# Altium schematic sheet Stepper Motor3.SchDoc
size A2; SheetNumber: 6; SheetTotal: 9
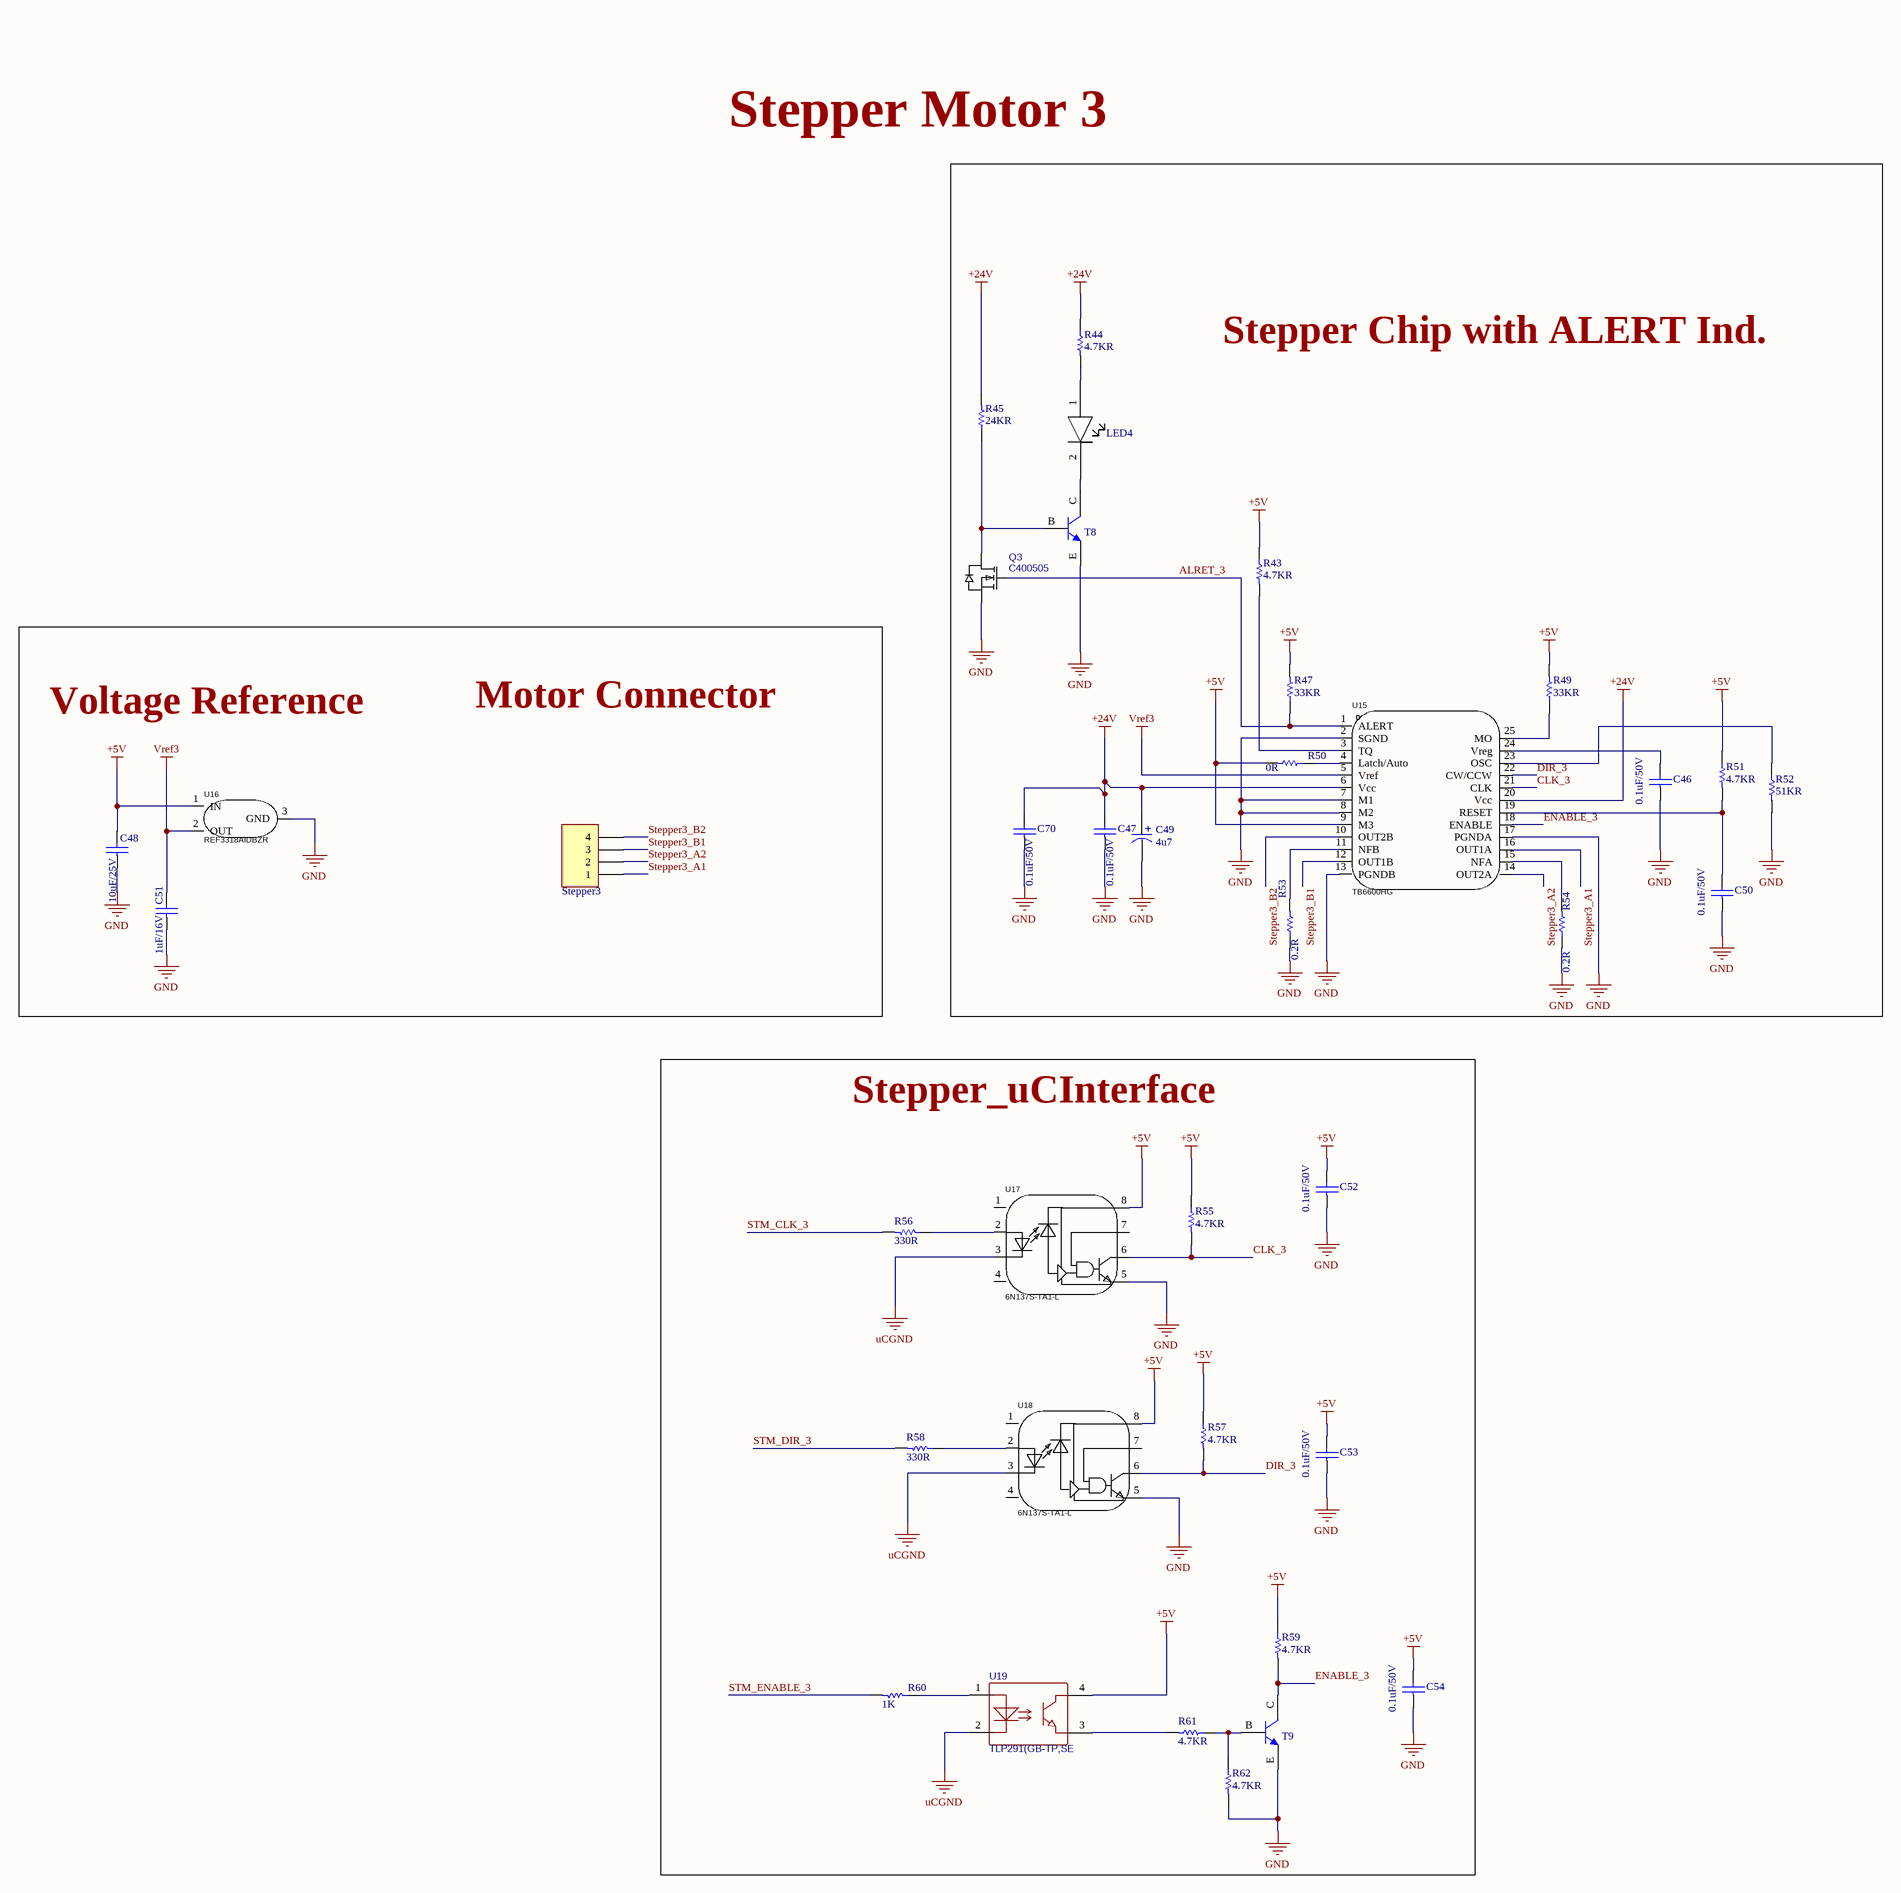
[diagram p0: Stepper Motor3.SchDoc]

## Parts
C46  0.1uF/50V  [PCBComponent_1]
C47  0.1uF/50V  [PCBComponent_1]
C48  10uF/25V  [PCBComponent_1]
C49  4u7  [CAPLEAD_D6.3mm]
C50  0.1uF/50V  [PCBComponent_1]
C51  1uF/16V  [PCBComponent_1]
C52  0.1uF/50V  [PCBComponent_1]
C53  0.1uF/50V  [PCBComponent_1]
C54  0.1uF/50V  [PCBComponent_1]
C70  0.1uF/50V  [PCBComponent_1]
LED4  1206 LED  [1206 LED]  (value not drawn)
Q3  C400505  [SOT-23-3_L2.9-W1.3-P1.90-LS2.4-BR]
R43  4.7KR  [R0402]
R44  4.7KR  [R0402]
R45  24KR  [RESC1608X06N]
R47  33KR  [RESC1608X06N]
R49  33KR  [RESC1608X06N]
R50  0R  [RESC1608X06N]
R51  4.7KR  [R0402]
R52  51KR  [R0402]
R53  0.2R  [RESC6431X12N]
R54  0.2R  [RESC6431X12N]
R55  4.7KR  [R0402]
R56  330R  [R0402]
R57  4.7KR  [R0402]
R58  330R  [R0402]
R59  4.7KR  [R0402]
R60  1K  [R0402]
R61  4.7KR  [R0402]
R62  4.7KR  [R0402]
Stepper3  Header 4 Pin Polar  [PCBComponent_1]  (value not drawn)
T8  MMBT3904 Transistor  [MMBT3904]  (value not drawn)
T9  MMBT3904 Transistor  [MMBT3904]  (value not drawn)
U15  TB6600HG  [HZIP25-P-1.0_TB6600HG - HEATSINK]
U16  REF3318AIDBZR  [SOT-23-3_L2.9-W1.3-P1.90-LS2.4-BR]
U17  6N137S-TA1-L  [SOP-8_L9.8-W6.6-P2.54-LS10.3-BL]
U18  6N137S-TA1-L  [SOP-8_L9.8-W6.6-P2.54-LS10.3-BL]
U19  TLP291(GB-TP,SE  [SOP-4-1.27mm]

## Blocks framed on the sheet
Stepper Chip with ALERT Ind.: C46 C47 C49 C50 C70 LED4 Q3 R43-R45 R47 R49-R54 T8 U15
Stepper_uCInterface: C52-C54 R55-R62 T9 U17-U19

## Nets
+5V: C48.2 C52.2 C53.2 C54.2 R43.1 R47.2 R49.2 R50.2 R51.1 R55.1 R57.1 R59.1 U15.9(M3) U16.1(IN) U17.8 U18.8 U19.4
+24V: C47.2 C49.1 C70.2 R44.1 R45.2 U15.6(Vcc) U15.20(Vcc)
GND: C46.1 C47.1 C48.1 C49.2 C50.1 C51.1 C52.1 C53.1 C54.1 C70.1 Q3.2(S) R52.2 R53.1 R54.1 R62.2 T8.E T9.E U15.2(SGND) U15.7(M1) U15.8(M2) U15.13(PGNDB) U15.17(PGNDA) U16.3(GND) U17.5 U18.5
uCGND: U17.3 U18.3 U19.2
Vref3: C51.2 U15.5(Vref) U16.2(OUT)
ALRET_3: Q3.1(G) R47.1 U15.1(ALERT)
CLK_3: R55.2 U15.21(CLK) U17.6
DIR_3: R57.2 U15.22(CW/CCW) U18.6
ENABLE_3: R59.2 T9.C U15.18(ENABLE)
Stepper3_A1: Stepper3.1 U15.16(OUT1A)
Stepper3_A2: Stepper3.2 U15.14(OUT2A)
Stepper3_B1: Stepper3.3 U15.12(OUT1B)
Stepper3_B2: Stepper3.4 U15.10(OUT2B)
STM_CLK_3: R56.2
STM_DIR_3: R58.2
STM_ENABLE_3: R60.2
NetC46_2: C46.2 U15.24(Vreg)
NetC50_2: C50.2 R51.2 U15.19(RESET)
NetLED4_1: LED4.1 R44.2
NetLED4_2: LED4.2 T8.C
NetQ3_3: Q3.3(D) R45.1 T8.B
NetR43_2: R43.2 U15.3(TQ)
NetR49_1: R49.1 U15.25(MO)
NetR50_1: R50.1 U15.4(Latch/Auto)
NetR52_1: R52.1 U15.23(OSC)
NetR53_2: R53.2 U15.11(NFB)
NetR54_2: R54.2 U15.15(NFA)
NetR56_1: R56.1 U17.2
NetR58_1: R58.1 U18.2
NetR60_1: R60.1 U19.1
NetR61_1: R61.1 R62.1 T9.B
NetR61_2: R61.2 U19.3

Not connected (* = marked no-connect by the designer): U17 1(NC) 4(NC) 7; U18 1(NC) 4(NC) 7

## Notes on the sheet
- Stepper Motor 3
- Voltage Reference
- Motor Connector

## Library data of the parts
C46 C47 C50 C52-C54 C70 = 0603 Capacitor: C1591; Created By: NourAldin; DataSheet Link: https://eu.mouser.com/datasheet/2/400/lcc_automotive_general_en-843974.pdf; Mouser Link: https://eu.mouser.com/ProductDetail/TDK/CGA1A2X7R1H331M030BA?qs=sGAEpiMZZMs0AnBnWHyRQL8L3bkL%252bvtyS9XpSB1mk7rVV5K8%252bbxEeg%3d%3d
C48 = 0603 Capacitor: C96446; Created By: NourAldin; DataSheet Link: https://eu.mouser.com/datasheet/2/400/lcc_automotive_general_en-843974.pdf; Mouser Link: https://eu.mouser.com/ProductDetail/TDK/CGA1A2X7R1H331M030BA?qs=sGAEpiMZZMs0AnBnWHyRQL8L3bkL%252bvtyS9XpSB1mk7rVV5K8%252bbxEeg%3d%3d
C49 = A759EQ475M2AAAE160: C2691843; Manufacturer: KEMET; Supplier 1: Mouser; Manufacturer Part Number: A759EQ475M2AAAE160; RoHS: Yes; Category: Polymer Capacitors; Stock 1: 17219; Pricing 1: 1=0.97, 10=0.73, 50=0.73, 100=0.546, 1000=0.384, 10000=0.326 (USD); ComponentLink1URL: http://www.kemet.com/docfinder?Partnumber=A759EQ475M2AAAE160&src-supplier=Digikey; ComponentLink1Description: http://www.kemet.com/docfinder?Partnumber=A759EQ475M2AAAE160&src-supplier=Digikey; ComponentLink2URL: http://www.farnell.com/datasheets/2095614.pdf?src-supplier=Element14; ComponentLink2Description: http://www.farnell.com/datasheets/2095614.pdf?src-supplier=Element14; Supplier Part Number 1: 80-A759EQ475M2AAE160
C51 = 0603 Capacitor: C1592; Created By: NourAldin; DataSheet Link: https://eu.mouser.com/datasheet/2/400/lcc_automotive_general_en-843974.pdf; Mouser Link: https://eu.mouser.com/ProductDetail/TDK/CGA1A2X7R1H331M030BA?qs=sGAEpiMZZMs0AnBnWHyRQL8L3bkL%252bvtyS9XpSB1mk7rVV5K8%252bbxEeg%3d%3d
LED4 = 1206 LED: C434438; Created By: NourAldin
Q3 = BSS138_MOSFET: Manufacturer: YANGJIE(扬杰); Manufacturer Part: BSS138; Contributor: LCSC; Supplier: LCSC; Supplier Part: C400505; JLCPCB Part Class: Extended Part; spicePre: Q; spiceSymbolName: BSS138_C400505
R43 R44 R51 R55 R57 R59 R61 R62 = 0402 Resistor: C105871
R45 = 0603 Resistor: C2930081; Created By: NourAldin; Mouser Link: https://eu.mouser.com/ProductDetail/Panasonic/ERA-3AHD180V?qs=sGAEpiMZZMvdGkrng054t5mej2KPdPuFSlDBd1tSiF0%3d; DataSheet Link: https://eu.mouser.com/datasheet/2/315/AOA0000C307-1149632.pdf
R47 R49 = 0603 Resistor: C126359; Created By: NourAldin; Mouser Link: https://eu.mouser.com/ProductDetail/Panasonic/ERA-3AHD180V?qs=sGAEpiMZZMvdGkrng054t5mej2KPdPuFSlDBd1tSiF0%3d; DataSheet Link: https://eu.mouser.com/datasheet/2/315/AOA0000C307-1149632.pdf
R50 = 0603 Resistor: C100044; Created By: NourAldin; Mouser Link: https://eu.mouser.com/ProductDetail/Panasonic/ERA-3AHD180V?qs=sGAEpiMZZMvdGkrng054t5mej2KPdPuFSlDBd1tSiF0%3d; DataSheet Link: https://eu.mouser.com/datasheet/2/315/AOA0000C307-1149632.pdf
R52 = 0402 Resistor: C107230
R53 R54 = 2512 Resistor: C2903473; Created By: NourAldin; Mouser Link: https://eu.mouser.com/ProductDetail/Bourns/CSS2H-2512K-2L00F?qs=sGAEpiMZZMukHu%252bjC5l7YewuupLM8jZrvWs15Y6t0rY%3D&fbclid=IwAR0ZD_uc1Y03YG_KyYG8NxrpBzYgFzVeevvjxrlqtGWJ1HKz-jrYfqlFWCw; DataSheet Link: https://eu.mouser.com/datasheet/2/54/ss2h-2512-1302652.pdf
R56 R58 = 0402 Resistor: C105875
R60 = 0402 Resistor: C106235
Stepper3 = Header 4 Pin Polar: C144395
T8 T9 = MMBT3904 Transistor: C108429; Created By: NourAldin
U15 = TB6600HG: C66042; Manufacturer: TOSHIBA(东芝); Add into BOM: yes; Symbol: TB6600HG; Device: TB6600HG; LCSC Part Name: 4.5A 42V电机驱动芯片; Supplier Part: C66042; Manufacturer Part: TB6600HG; Supplier Footprint: HZIP-25-P-1mm; JLCPCB Part Class: Extended Part; Datasheet: https://atta.szlcsc.com/upload/public/pdf/source/20170511/1494500127812.pdf; Supplier: LCSC; Convert to PCB: yes
U16 = REF3318AIDBZR: C115877; Manufacturer: TI(德州仪器); Add into BOM: yes; Output Type: Fixed; Input Voltage: 2V~5.5V; Output Voltage: 1.8V; Output Current: 5mA; Tolerance: ±0.15%; Temperature Coefficient: 30ppm/℃; Reference Type: series connection; Supply Current: 8.5uA; Noise - 1/10Hz to 10Hz: 50uVp-p; Symbol: REF3318AIDBZR; Device: REF3318AIDBZR; LCSC Part Name: REF3318AIDBZR; Supplier Part: C115877; Manufacturer Part: REF3318AIDBZR; Supplier Footprint: SOT-23; JLCPCB Part Class: Extended Part; Datasheet: https://www.ti.com/cn/lit/gpn/ref3318; Supplier: LCSC; Convert to PCB: yes; Noise - 10Hz to 10kHz: -; Operating Temperature: -40℃~+125℃@(Ta)
U17 U18 = 6N137S-TA1-L: C92651; Manufacturer: LITEON(光宝); Add into BOM: yes; Input Type: DC; Supply Voltage: 4.5V~5.5V; Common Mode Transient Immunity (CMTI): 10kV/us; Data Rate: 15Mbit/s; Propagation Delay tpLH/tpHL: 32ns；40ns; Number of Channels: 1; Symbol: 6N137S-TA1; Device: 6N137S-TA1-L; LCSC Part Name: DC输入 1通道; Supplier Part: C92651; Manufacturer Part: 6N137S-TA1-L; Supplier Footprint: SOP-8-2.54mm; JLCPCB Part Class: Extended Part; Datasheet: https://atta.szlcsc.com/upload/public/pdf/source/20191018/C92651_D1F9F6F1F10C7EC7C3739E5ECB700036.pdf; Supplier: LCSC; Convert to PCB: yes; Operating Temperature: -40℃~+85℃
U19 = TLP291(GB-TP,SE(T: C55144; BOM_Manufacturer: TOSHIBA(东芝); BOM_Supplier: LCSC; Manufacturer Part Number: TLP291(GB-TP,SE; Supplier Part Number 2: C55144; BOM_JLCPCB Part Class: Extended Part; LCSC Link: https://www.lcsc.com/product-detail/Optocouplers-Phototransistor-Output_TOSHIBA-TLP291-GB-TP-SE_C55144.html; spiceSymbolName: TLP291(GB-TP,SE(T